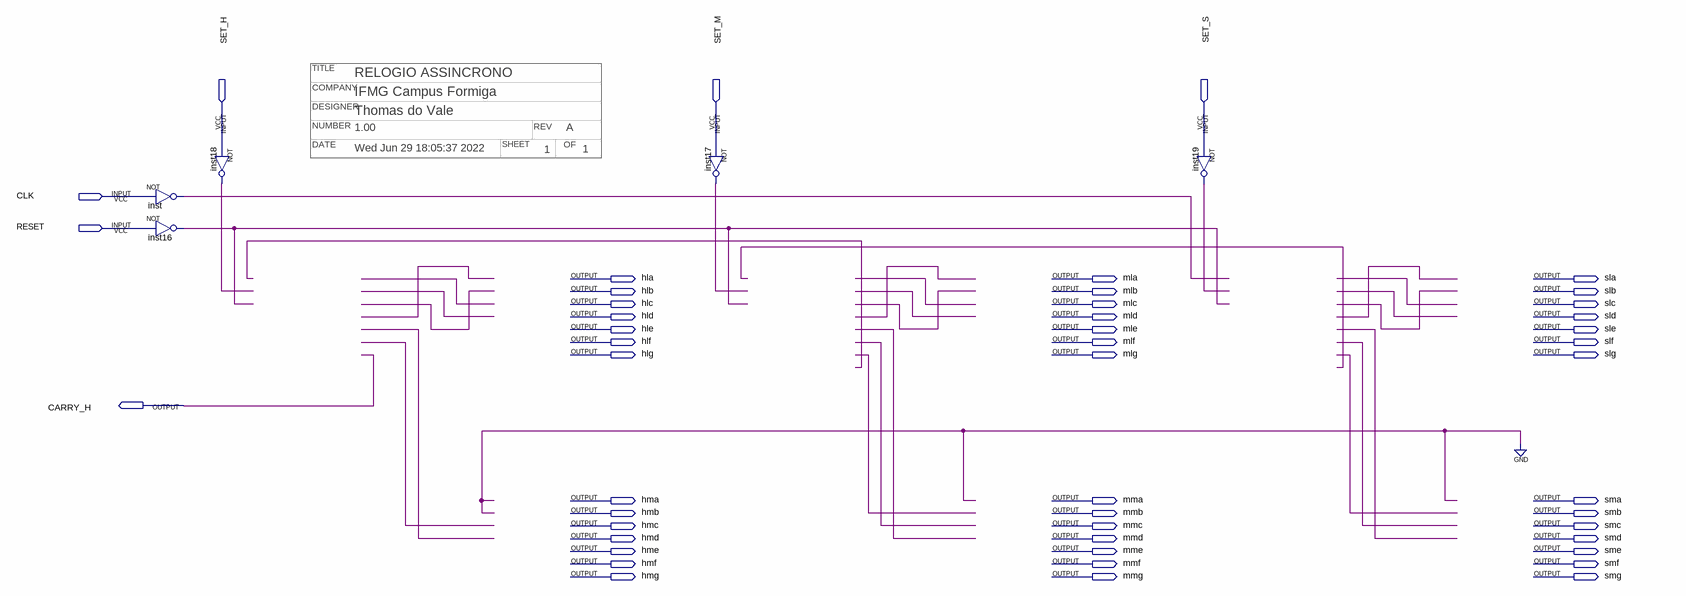
[diagram p0: schematic sheet]
// Quartus schematic teste.bdf as structural Verilog: 5 symbols, 48 pins
// Title block: COMPANY: IFMG Campus Formiga; DATE: Wed Jun 29 18:05:37 2022; DESIGNER: Thomas do Vale; NUMBER: 1.00; OF: 1; REV: A; SHEET: 1; TITLE: RELOGIO ASSINCRONO
module teste (
  input  SET_H,
  input  SET_M,
  input  SET_S,
  input  CLK,
  input  RESET,
  output hla,
  output mla,
  output sla,
  output hlb,
  output mlb,
  output slb,
  output hlc,
  output mlc,
  output slc,
  output hld,
  output mld,
  output sld,
  output hle,
  output mle,
  output sle,
  output hlf,
  output mlf,
  output slf,
  output hlg,
  output mlg,
  output slg,
  output CARRY_H,
  output hma,
  output mma,
  output sma,
  output hmb,
  output mmb,
  output smb,
  output hmc,
  output mmc,
  output smc,
  output hmd,
  output mmd,
  output smd,
  output hme,
  output mme,
  output sme,
  output hmf,
  output mmf,
  output smf,
  output hmg,
  output mmg,
  output smg
);

  wire inst16_out, inst17_out, inst18_out, inst19_out, inst_out;

  not inst (inst_out, CLK);
  not inst16 (inst16_out, RESET);
  not inst18 (inst18_out, SET_H);
  not inst17 (inst17_out, SET_M);
  not inst19 (inst19_out, SET_S);
endmodule
